# EAGLE design ParasiteR2 (EAGLE 9.5.2)
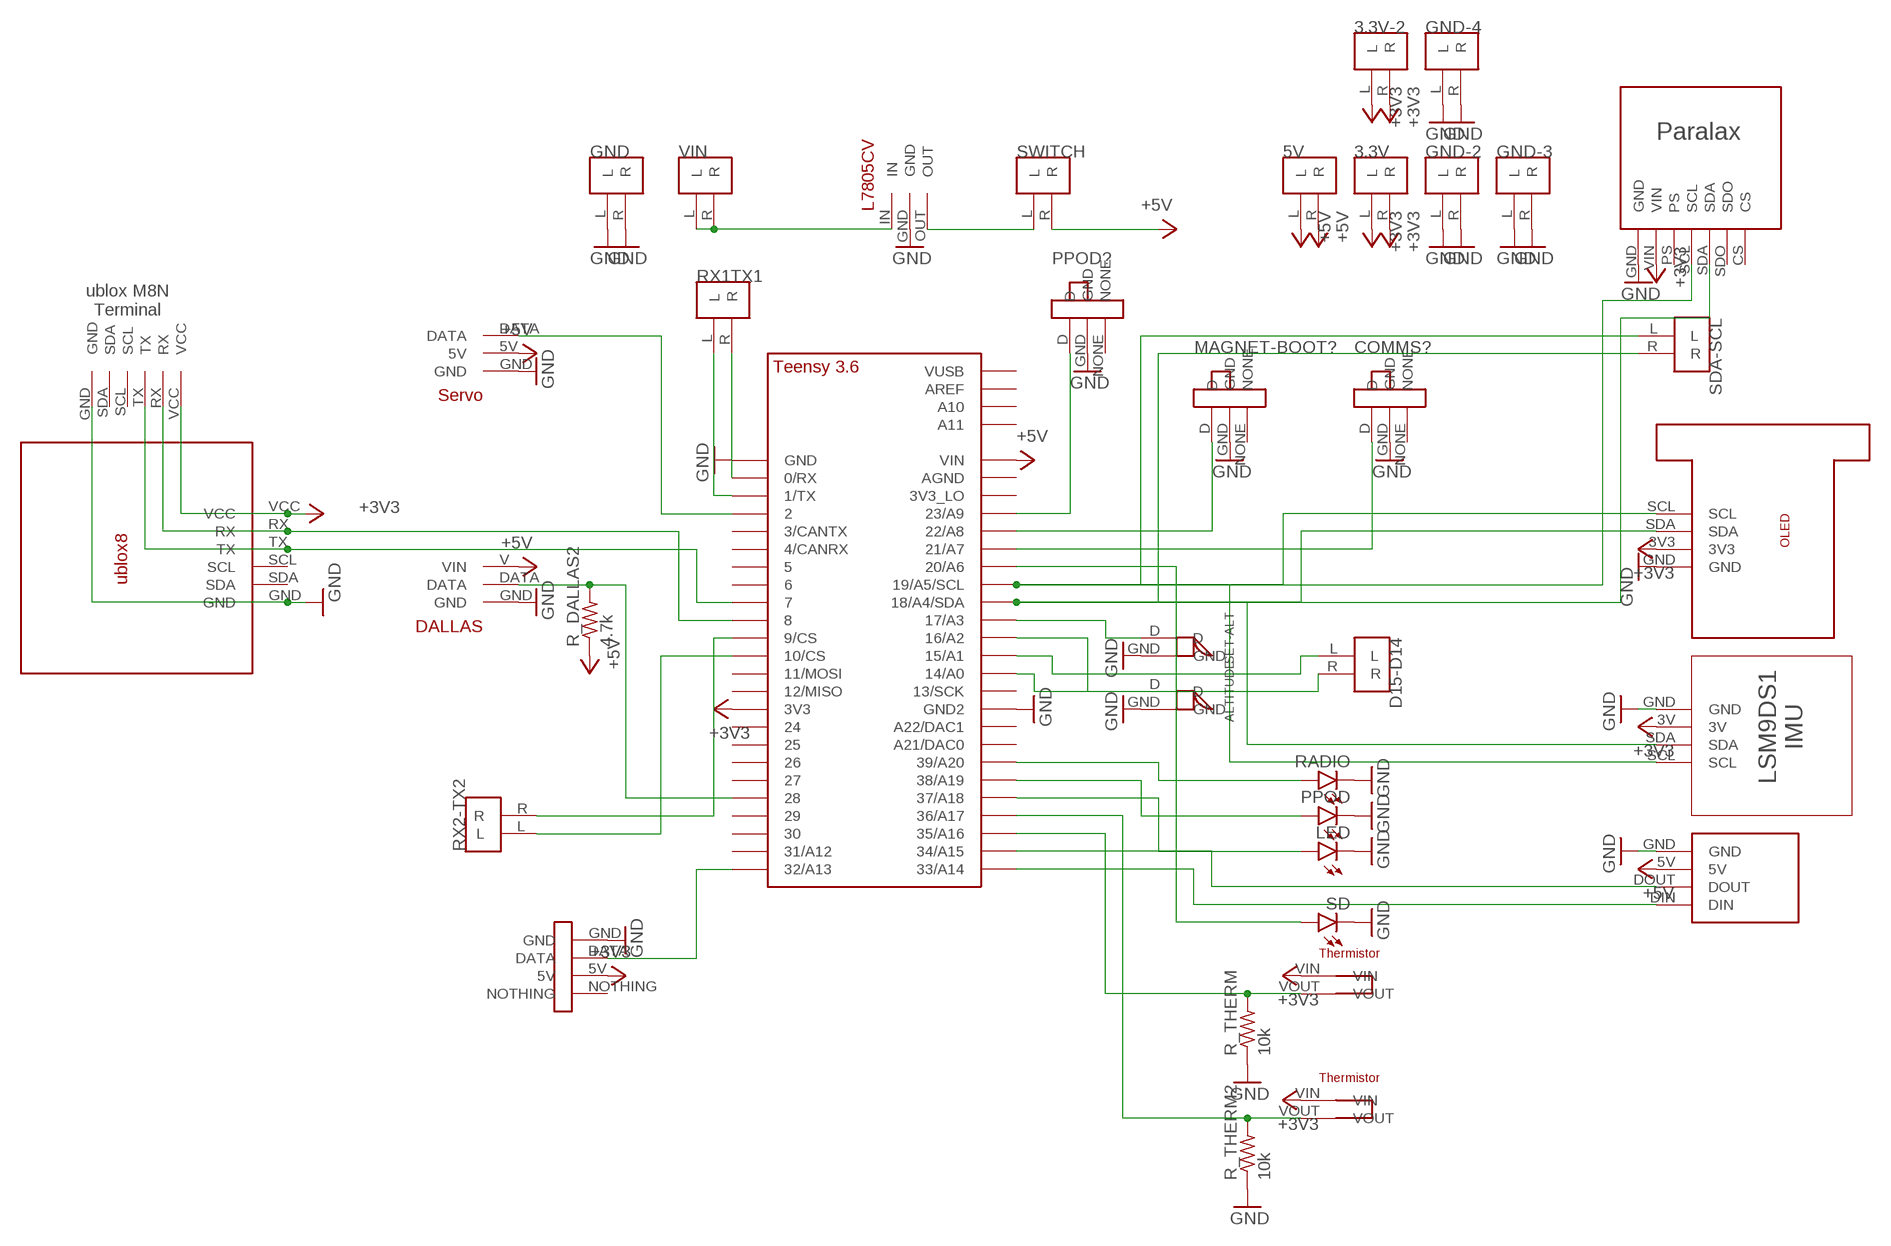
[diagram p0: schematic, sheet 1]

## Parts
3.3V  TERMINALBLOCK  [TERMINALBLOCK]
3.3V-2  TERMINALBLOCK  [TERMINALBLOCK]
5V  TERMINALBLOCK  [TERMINALBLOCK]
ALTITUDE  MOMENTSWITCH  [MOMENTSWITCH]
COMMS?  SLIDESWITCH  [SLIDESWITCH]
D15-D14  TERMINALBLOCK  [TERMINALBLOCK]
GND  TERMINALBLOCK  [TERMINALBLOCK]
GND-2  TERMINALBLOCK  [TERMINALBLOCK]
GND-3  TERMINALBLOCK  [TERMINALBLOCK]
GND-4  TERMINALBLOCK  [TERMINALBLOCK]
LED  LED5MM  [LED5MM]
MAGNET-BOOT?  SLIDESWITCH  [SLIDESWITCH]
PPOD  LED5MM  [LED5MM]
PPOD?  SLIDESWITCH  [SLIDESWITCH]
R_DALLAS2  4.7k  R-US_0207/12  [0207/12]
R_THERM  10k  R-US_0207/12  [0207/12]
R_THERM2  10k  R-US_0207/12  [0207/12]
RADIO  LED5MM  [LED5MM]
RX1TX1  RX1 TX1  TERMINALBLOCK  [TERMINALBLOCK]
RX2-TX2  TERMINALBLOCK  [TERMINALBLOCK]
SD  LED5MM  [LED5MM]
SDA-SCL  TERMINALBLOCK  [TERMINALBLOCK]
SET-ALT  MOMENTSWITCH  [MOMENTSWITCH]
SWITCH  TERMINALBLOCK  [TERMINALBLOCK]
U$1  TEENSY_3.5/3.6_BASIC  [TEENSY_3.5/3.6_BASIC]
U$2  XBEE  [XBEE]
U$3  LSM9DS1  [LSM9DS1]
U$4  L7805CV  [L7805CV]
U$5  DALLAS  [DALLAS]
U$6  MS5607  [MS5607]
U$7  SERVO  [SERVO]
U$8  UBLOX8  [UBLOX8]
U$9  OLED  [OLED]
U$10  UBLOX8-TERMINALBL  [UBLOX8-TERMINALBL]
U$11  HONEYWELL  [HONEYWELL]
U$20  THERMISTOR  [THERMISTOR]
U$21  THERMISTOR  [THERMISTOR]
VIN  TERMINALBLOCK  [TERMINALBLOCK]

## Nets
+3V3: 3.3V-2.L 3.3V-2.R 3.3V.L 3.3V.R U$1.3V3 U$3.3V U$6.VIN U$8.VCC U$9.3V3 U$10.VCC U$11.5V U$20.VIN U$21.VIN
+5V: 5V.L 5V.R R_DALLAS2.1 SWITCH.R U$1.VIN U$2.5V U$5.V(VIN) U$7.5V
GND: ALTITUDE.GND COMMS?.GND GND-2.L GND-2.R GND-3.L GND-3.R GND-4.L GND-4.R GND.L GND.R LED.K(C) MAGNET-BOOT?.GND PPOD.K(C) PPOD?.GND R_THERM2.1 R_THERM.1 RADIO.K(C) SD.K(C) SET-ALT.GND U$1.GND U$1.GND2 U$2.GND U$3.GND U$4.GND U$5.GND U$6.GND U$7.GND U$8.GND U$9.GND U$10.GND U$11.GND
N$1: U$1.34/A15 U$2.DOUT
N$2: U$1.33/A14 U$2.DIN
N$3: SDA-SCL.R U$1.18/A4/SDA U$3.SDA U$6.SDA U$9.SDA
N$4: SDA-SCL.L U$1.19/A5/SCL U$3.SCL U$6.SCL U$9.SCL
N$5: U$1.7 U$8.TX U$10.TX
N$6: U$1.8 U$8.RX U$10.RX
N$7: SWITCH.L U$4.OUT
N$8: U$4.IN VIN.L VIN.R
N$9: D15-D14.L U$1.15/A1
N$10: R_DALLAS2.2 U$1.28 U$5.DATA
N$11: U$1.2 U$7.DATA
N$12: U$1.32/A13 U$11.DATA
N$13: SD.A U$1.20/A6
N$14: RX2-TX2.R U$1.9/CS
N$15: RX2-TX2.L U$1.10/CS
N$16: R_THERM.2 U$1.35/A16 U$20.VOUT
N$17: R_THERM2.2 U$1.36/A17 U$21.VOUT
N$18: RX1TX1.R U$1.0/RX
N$19: RX1TX1.L U$1.1/TX
N$20: PPOD?.D U$1.23/A9
N$21: MAGNET-BOOT?.D U$1.22/A8
N$22: SET-ALT.D U$1.17/A3
N$23: ALTITUDE.D U$1.16/A2
N$24: COMMS?.D U$1.21/A7
N$25: RADIO.A U$1.39/A20
N$26: PPOD.A U$1.38/A19
N$27: LED.A U$1.37/A18
N$28: D15-D14.R U$1.14/A0
Unconnected: COMMS?.NONE MAGNET-BOOT?.NONE PPOD?.NONE U$1.3/CANTX U$1.3V3_LO U$1.4/CANRX U$1.5 U$1.6 U$1.11/MOSI U$1.12/MISO U$1.13/SCK U$1.21/DAC0(A21/DAC0) U$1.24 U$1.25 U$1.26 U$1.27 U$1.29 U$1.30 U$1.31/A12 U$1.A10 U$1.A11 U$1.A22/DAC1 U$1.AGND U$1.AREF U$1.VUSB U$6.CS U$6.PS U$6.SDO U$8.SCL U$8.SDA U$10.SCL U$10.SDA U$11.NOTHING

## Library data of the parts
3.3V 3.3V-2 5V D15-D14 GND GND-2-GND-4 RX1TX1 RX2-TX2 SDA-SCL SWITCH VIN = TERMINALBLOCK:TERMINALBLOCK; TBL: hi
ALTITUDE SET-ALT = MomentarySwitch:MOMENTSWITCH
COMMS? MAGNET-BOOT? PPOD? = SlideSwitch:SLIDESWITCH
LED PPOD RADIO SD = led:LED: LED OSRAM: - CHIPLED LG R971, LG N971, LY N971, LG Q971, LY Q971, LO R971, LY R971 LH N974, LH R974 LS Q976, LO Q976, LY Q976 LO Q996 - Hyper CHIPLED LW Q18S LB Q993, LB Q99A, LB R99A - SideLED LS A670, LO A670, LY A670, LG A670, LP A670 LB A673, LV A673, LT A673, LW A673 LH A674 LY A675 LS A676, LA A676, LO A676, LY A676, LW A676 LS A679, LY A679, LG A679 - Hyper Micro SIDELED® LS Y876, LA Y876, LO Y876, LY Y876 LT Y87S - SmartLED LW L88C, LW L88S LB L89C, LB L89S, LG L890 LS L89K, LO L89K, LY L89K LS L896, LA L896, LO L896, LY L896 - TOPLED LS T670, LO T670, LY T670, LG T670, LP T670 LSG T670, LSP T670, LSY T670, LOP T670, LYG T670 LG T671, LOG T671, LSG T671 LB T673, LV T673, LT T673, LW T673 LH T674 LS T676, LA T676, LO T676, LY T676, LB T676, LH T676, LSB T676, LW T676 LB T67C, LV T67C, LT T67C, LS T67K, LO T67K, LY T67K, LW E67C LS E67B, LA E67B, LO E67B, LY E67B, LB E67C, LV E67C, LT E67C LW T67C LS T679, LY T679, LG T679 LS T770, LO T770, LY T770, LG T770, LP T770 LB T773, LV T773, LT T773, LW T773 LH T774 LS E675, LA E675, LY E675, LS T675 LS T776, LA T776, LO T776, LY T776, LB T776 LHGB T686 LT T68C, LB T68C - Hyper Mini TOPLED® LB M676 - Mini TOPLED Santana® LG M470 LS M47K, LO M47K, LY M47K Source: http://www.osram.convergy.de LUXEON: - LUMILED® LXK2-PW12-R00, LXK2-PW12-S00, LXK2-PW14-U00, LXK2-PW14-V00 LXK2-PM12-R00, LXK2-PM12-S00, LXK2-PM14-U00 LXK2-PE12-Q00, LXK2-PE12-R00, LXK2-PE12-S00, LXK2-PE14-T00, LXK2-PE14-U00 LXK2-PB12-K00, LXK2-PB12-L00, LXK2-PB12-M00, LXK2-PB14-N00, LXK2-PB14-P00, LXK2-PB14-Q00 LXK2-PR12-L00, LXK2-PR12-M00, LXK2-PR14-Q00, LXK2-PR14-R00 LXK2-PD12-Q00, LXK2-PD12-R00, LXK2-PD12-S00 LXK2-PH12-R00, LXK2-PH12-S00 LXK2-PL12-P00, LXK2-PL12-Q00, LXK2-PL12-R00 Source: www.luxeon.com KINGBRIGHT: KA-3528ASYC Source: www.kingbright.com
R_DALLAS2 R_THERM R_THERM2 = rcl:R-US_: RESISTOR, American symbol; SPICEPREFIX: R
U$1 = Teensy356:TEENSY_3.5/3.6_BASIC
U$2 = XBEE:XBEE
U$3 = LSM9DS1:LSM9DS1
U$4 = L7805CV:L7805CV
U$5 = DALLAS:DALLAS
U$6 = ParallaxAltimeter:MS5607
U$7 = SERVO:SERVO
U$8 = ublox8:UBLOX8
U$9 = OLED:OLED
U$10 = ublox8:UBLOX8-TERMINALBL
U$11 = HONEYWELL:HONEYWELL
U$20 U$21 = THERMISTOR:THERMISTOR

## Board
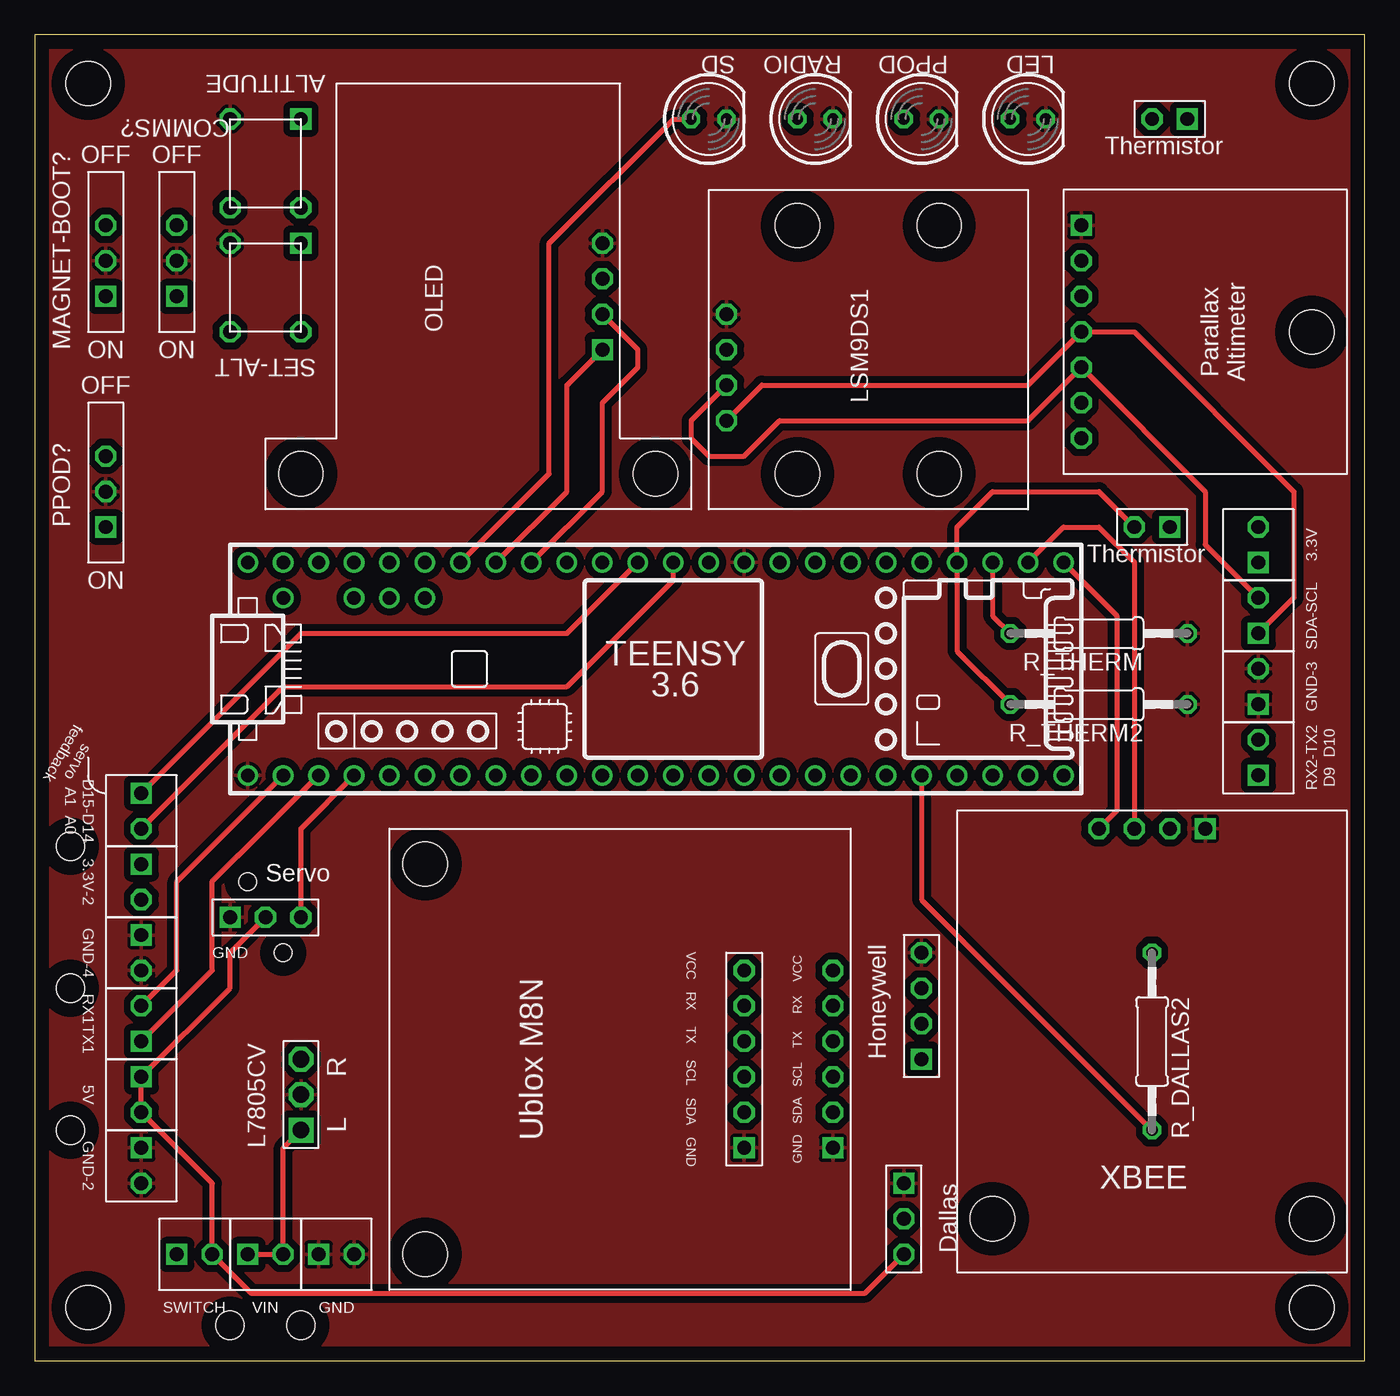
[diagram p1: board, top side]
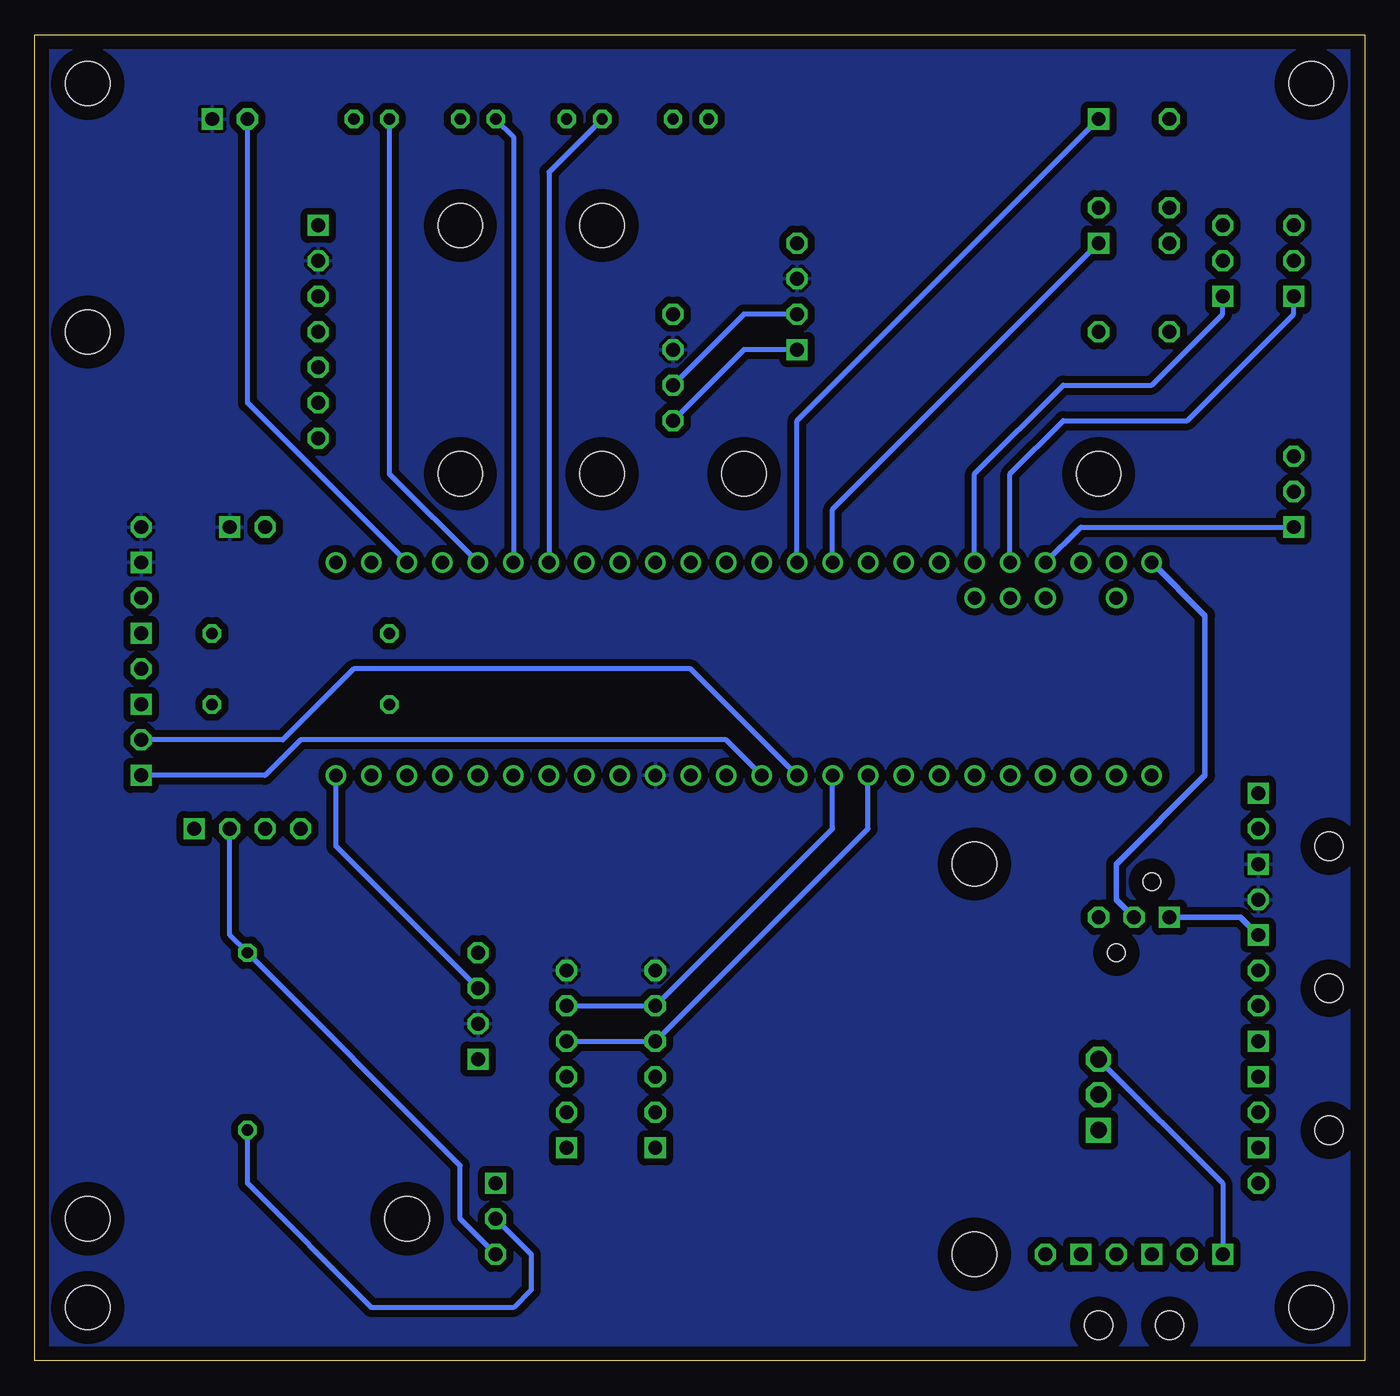
[diagram p2: board, bottom side, seen from below]

Size 95.23 x 94.92 mm. Coordinates in mm from the lower left corner, seen from the top.
Outline: 0,0 95.23,0 95.23,94.92 0,94.92 0,0
Copper layers (1*16): Top 0.035mm / dielectric 1.5mm / Bottom 0.035mm
Design rules "default": minimum track width 6mil, minimum drill 0.35mm, track to track 6mil, track to pad 6mil, pad to pad 6mil, via to via 6mil, smd to smd 6mil, copper to edge 40mil, drill to drill 6mil, minimum pad ring 10mil, minimum via ring 8mil, stop-mask expansion 4mil, vias tented up to drill 0mil, thermal gap 10mil
Holes 3.17 mm at 3.81,91.44 91.44,91.44 91.44,3.81 3.81,3.81
Holes 2.03 mm at 19.05,2.54 13.97,2.54 2.54,36.83 2.54,26.67 2.54,16.51

### Footprints (pad centres in the part's own frame; a part is rotated, then mirrored left to right if it is on the bottom)
TERMINALBLOCK = drill 1 square: L 1.27,2.54 | drill 1 octagon: R 3.81,2.54
MOMENTSWITCH = drill 1 square: D 1.27,1.27 | drill 1 octagon: GND 6.35,1.27; P$3 6.35,7.62; P$4 1.27,7.62
SLIDESWITCH = drill 1 square: D 2.54,1.27 | drill 1 octagon: GND 5.08,1.27; NONE 7.62,1.27
LED5MM = drill 0.813 octagon: A -1.27,0; K 1.27,0
0207/12 = drill 0.813 octagon: 1 -6.35,0; 2 6.35,0
TEENSY_3.5/3.6_BASIC = drill 0.965: 0/RX -25.4,-7.62; 1/TX -22.86,-7.62; 2 -20.32,-7.62; 3/CANTX -17.78,-7.62; 3V3 7.62,-7.62; 3V3_LO -22.86,7.62; 4/CANRX -15.24,-7.62; 5 -12.7,-7.62; 6 -10.16,-7.62; 7 -7.62,-7.62; 8 -5.08,-7.62; 9/CS -2.54,-7.62; 10/CS 0,-7.62; 11/MOSI 2.54,-7.62; 12/MISO 5.08,-7.62; 13/SCK 5.08,7.62; 14/A0 2.54,7.62; 15/A1 0,7.62; 16/A2 -2.54,7.62; 17/A3 -5.08,7.62; 18/A4/SDA -7.62,7.62; 19/A5/SCL -10.16,7.62; 20/A6 -12.7,7.62; 21/A7 -15.24,7.62; 21/DAC0 12.7,7.62; 22/A8 -17.78,7.62; 23/A9 -20.32,7.62; 24 10.16,-7.62; 25 12.7,-7.62; 26 15.24,-7.62; 27 17.78,-7.62; 28 20.32,-7.62; 29 22.86,-7.62; 30 25.4,-7.62; 31/A12 27.94,-7.62; 32/A13 30.48,-7.62; 33/A14 30.48,7.62; 34/A15 27.94,7.62; 35/A16 25.4,7.62; 36/A17 22.86,7.62; 37/A18 20.32,7.62; 38/A19 17.78,7.62; 39/A20 15.24,7.62; A10 -17.78,5.08; A11 -15.24,5.08; A22/DAC1 10.16,7.62; AGND -25.4,7.62; AREF -20.32,5.08; GND -27.94,-7.62; GND2 7.62,7.62; VIN -27.94,7.62; VUSB -25.4,5.08
XBEE = drill 1 octagon: 5V 12.7,1.27; DIN 17.78,1.27; DOUT 15.24,1.27 | drill 1 square: GND 10.16,1.27 | hole 3.175: 2.54,29.21; 25.4,29.21
LSM9DS1 = drill 1 octagon: 3V 11.43,21.59; GND 13.97,21.59; SCL 6.35,21.59; SDA 8.89,21.59 | hole 3.175: 2.54,6.35; 2.54,16.51; 20.32,16.51; 20.32,6.35
L7805CV = drill 1.194 octagon: GND 3.81,1.27; OUT 6.35,1.27 | drill 1.194 square: IN 1.27,1.27
DALLAS = drill 1 octagon: DATA 3.81,1.27; V 6.35,1.27 | drill 1 square: GND 1.27,1.27
MS5607 = drill 1 octagon: CS 17.78,1.27; PS 7.62,1.27; SCL 10.16,1.27; SDA 12.7,1.27; SDO 15.24,1.27; VIN 5.08,1.27 | drill 1 square: GND 2.54,1.27 | hole 3.175: 10.16,17.78
SERVO = drill 1 octagon: 5V 3.81,1.27; DATA 6.35,1.27 | drill 1 square: GND 1.27,1.27 | hole 1.27: 2.54,3.81; 5.08,-1.27
UBLOX8 = drill 1 square: GND 10.16,1.27 | drill 1 octagon: RX 20.32,1.27; SCL 15.24,1.27; SDA 12.7,1.27; TX 17.78,1.27; VCC 22.86,1.27 | hole 3.175: 2.54,30.48; 30.48,30.48
OLED = drill 1 octagon: 3V3 6.35,1.27; GND 8.89,1.27; SDA 3.81,1.27 | drill 1 square: SCL 1.27,1.27 | hole 3.175: -7.62,22.86; -7.62,-2.54
UBLOX8-TERMINALBL = drill 1 square: GND 1.27,1.27 | drill 1 octagon: RX 11.43,1.27; SCL 6.35,1.27; SDA 3.81,1.27; TX 8.89,1.27; VCC 13.97,1.27
HONEYWELL = drill 1 octagon: 5V 3.81,-1.27; DATA 6.35,-1.27; GND 8.89,-1.27 | drill 1 square: NOTHING 1.27,-1.27
THERMISTOR = drill 1 square: VIN 1.27,1.27 | drill 1 octagon: VOUT 3.81,1.27

### Placement (x,y rotation side)
3.3V  90.17,55.88 90 top
3.3V-2  5.08,36.83 270 top
5V  5.08,21.59 270 top
ALTITUDE  20.32,90.17 180 top
COMMS?  11.43,73.66 90 top
D15-D14  5.08,41.91 270 top
GND  19.05,5.08 0 top
GND-2  5.08,16.51 270 top
GND-3  90.17,45.72 90 top
GND-4  5.08,31.75 270 top
LED  71.12,88.9 0 top
MAGNET-BOOT?  6.35,73.66 90 top
PPOD  63.5,88.9 0 top
PPOD?  6.35,57.15 90 top
R_DALLAS2  80.01,22.86 270 top
R_THERM  76.2,52.07 180 top
R_THERM2  76.2,46.99 180 top
RADIO  55.88,88.9 0 top
RX1TX1  10.16,21.59 90 top
RX2-TX2  90.17,40.64 90 top
SD  48.26,88.9 0 top
SDA-SCL  90.17,50.8 90 top
SET-ALT  20.32,81.28 180 top
SWITCH  8.89,5.08 0 top
U$1  43.18,49.53 0 top
U$2  93.98,39.37 180 top
U$3  71.12,60.96 90 top
U$4  20.32,15.24 90 top
U$5  60.96,13.97 270 top
U$6  73.66,83.82 270 top
U$7  12.7,30.48 0 top
U$8  58.42,5.08 90 top
U$9  41.91,71.12 90 top
U$10  52.07,13.97 90 top
U$11  62.23,20.32 90 top
U$20  83.82,90.17 180 top
U$21  82.55,60.96 180 top
VIN  13.97,5.08 0 top

### Tracks (layer width: path | path; a pad name or v marks a point on that pad's centre or on a via)
+3V3
  pour Bottom (isolate 0.508): -1.27,96.52 -1.27,-1.27 95.25,-1.27 95.25,96.52
+5V
  Top 0.356: U$5.V 59.45,4.84 15.48,4.84 SWITCH.R 12.7,12.7 5V.R 5V.L 13.97,26.67 13.97,29.21 U$7.5V
  Bottom 0.356: U$5.V 64.77,10.16 64.77,13.97 R_DALLAS2.1 81.28,30.48 U$2.5V
  Bottom 0.406: U$7.5V 17.78,33.02 17.78,35.56 11.43,41.91 11.43,53.34 U$1.VIN
GND
  Bottom 0.406: GND-4.L 8.89,31.75 U$7.GND
  pour Top (isolate 0.508): -2.54,96.52 -2.54,-1.27 96.52,-1.27 96.52,96.52
N$1
  Top 0.356: U$1.34/A15 73.66,59.69 76.2,59.69 78.74,57.15 U$2.DOUT
N$2
  Top 0.356: U$1.33/A14 77.47,53.34 77.47,39.37 U$2.DIN
N$3
  Top 0.356: U$3.SDA 46.99,67.31 46.99,66.04 48.26,64.77 50.8,64.77 53.34,67.31 71.12,67.31 U$6.SDA 83.82,62.23 83.82,58.42 SDA-SCL.R | U$1.18/A4/SDA 40.64,62.23 40.64,68.58 43.18,71.12 43.18,72.39 U$9.SDA
  Bottom 0.356: U$9.SDA 44.45,74.93 U$3.SDA
N$4
  Top 0.356: U$3.SCL 52.07,69.85 71.12,69.85 U$6.SCL 78.74,73.66 90.17,62.23 90.17,54.61 SDA-SCL.L | U$1.19/A5/SCL 38.1,62.23 38.1,69.85 U$9.SCL
  Bottom 0.356: U$9.SCL 44.45,72.39 U$3.SCL
N$5
  Bottom 0.356: U$1.7 35.56,38.1 U$10.TX U$8.TX
N$6
  Bottom 0.356: U$1.8 38.1,38.1 U$10.RX U$8.RX
N$7
  Bottom 0.356: U$4.OUT 10.16,12.7 SWITCH.L
N$8
  Top 0.356: U$4.IN 17.78,15.24 VIN.R VIN.L
N$9
  Top 0.356: D15-D14.L 19.05,52.07 38.1,52.07 U$1.15/A1
N$10
  Top 0.356: U$1.28 63.5,33.02 R_DALLAS2.2
  Bottom 0.356: U$5.DATA 59.69,7.62 59.69,5.08 60.96,3.81 71.12,3.81 80.01,12.7 R_DALLAS2.2
N$11
  Top 0.356: U$7.DATA 19.05,38.1 U$1.2
N$12
  Bottom 0.356: U$11.DATA 73.66,36.83 U$1.32/A13
N$13
  Top 0.356: U$1.20/A6 36.83,63.5 36.83,80.01 45.72,88.9 SD.A
N$14
  Bottom 0.356: U$1.9/CS 48.26,49.53 72.39,49.53 77.47,44.45 RX2-TX2.R
N$15
  Bottom 0.356: U$1.10/CS 45.72,44.45 76.2,44.45 78.74,41.91 RX2-TX2.L
N$16
  Top 0.356: U$1.35/A16 68.58,53.34 R_THERM.2
  Bottom 0.356: U$1.35/A16 80.01,68.58 U$20.VOUT
N$17
  Top 0.356: R_THERM2.2 66.04,50.8 U$1.36/A17 66.04,59.69 68.58,62.23 76.2,62.23 U$21.VOUT
N$18
  Top 0.356: RX1TX1.R 10.16,27.94 10.16,34.29 U$1.0/RX
N$19
  Top 0.356: RX1TX1.L 12.7,27.94 12.7,34.34 14.48,36.12 14.53,36.12 U$1.1/TX
N$20
  Bottom 0.356: U$1.23/A9 20.32,59.69 PPOD?.D
N$21
  Bottom 0.356: U$1.22/A8 25.4,63.5 21.59,67.31 12.7,67.31 5.08,74.93 MAGNET-BOOT?.D
N$22
  Bottom 0.356: U$1.17/A3 38.1,60.96 SET-ALT.D
N$23
  Bottom 0.356: U$1.16/A2 40.64,67.31 ALTITUDE.D
N$24
  Bottom 0.356: U$1.21/A7 27.94,63.5 21.59,69.85 15.24,69.85 10.16,74.93 COMMS?.D
N$25
  Bottom 0.356: RADIO.A 58.42,85.09 U$1.39/A20
N$26
  Bottom 0.356: PPOD.A 60.96,87.63 U$1.38/A19
N$27
  Bottom 0.356: LED.A 69.85,63.5 U$1.37/A18
N$28
  Top 0.356: D15-D14.R 17.78,48.26 38.1,48.26 45.72,55.88 U$1.14/A0

### Text on the board
tPlace: servo / feedback | GND | L R
tNames: D9 D10 | A1 A0